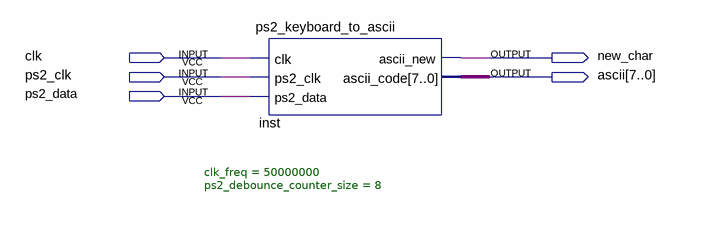
[diagram p0: schematic sheet]
// Quartus schematic ps2_module.bdf as structural Verilog: 1 symbols, 5 pins
module ps2_module (
  input  clk,
  input  ps2_clk,
  input  ps2_data,
  output new_char,
  output [7:0] ascii
);

  ps2_keyboard_to_ascii #(.clk_freq(50000000), .ps2_debounce_counter_size(8)) inst (
    .clk(clk), .ps2_clk(ps2_clk), .ps2_data(ps2_data), .ascii_new(new_char), .ascii_code(ascii));
endmodule
